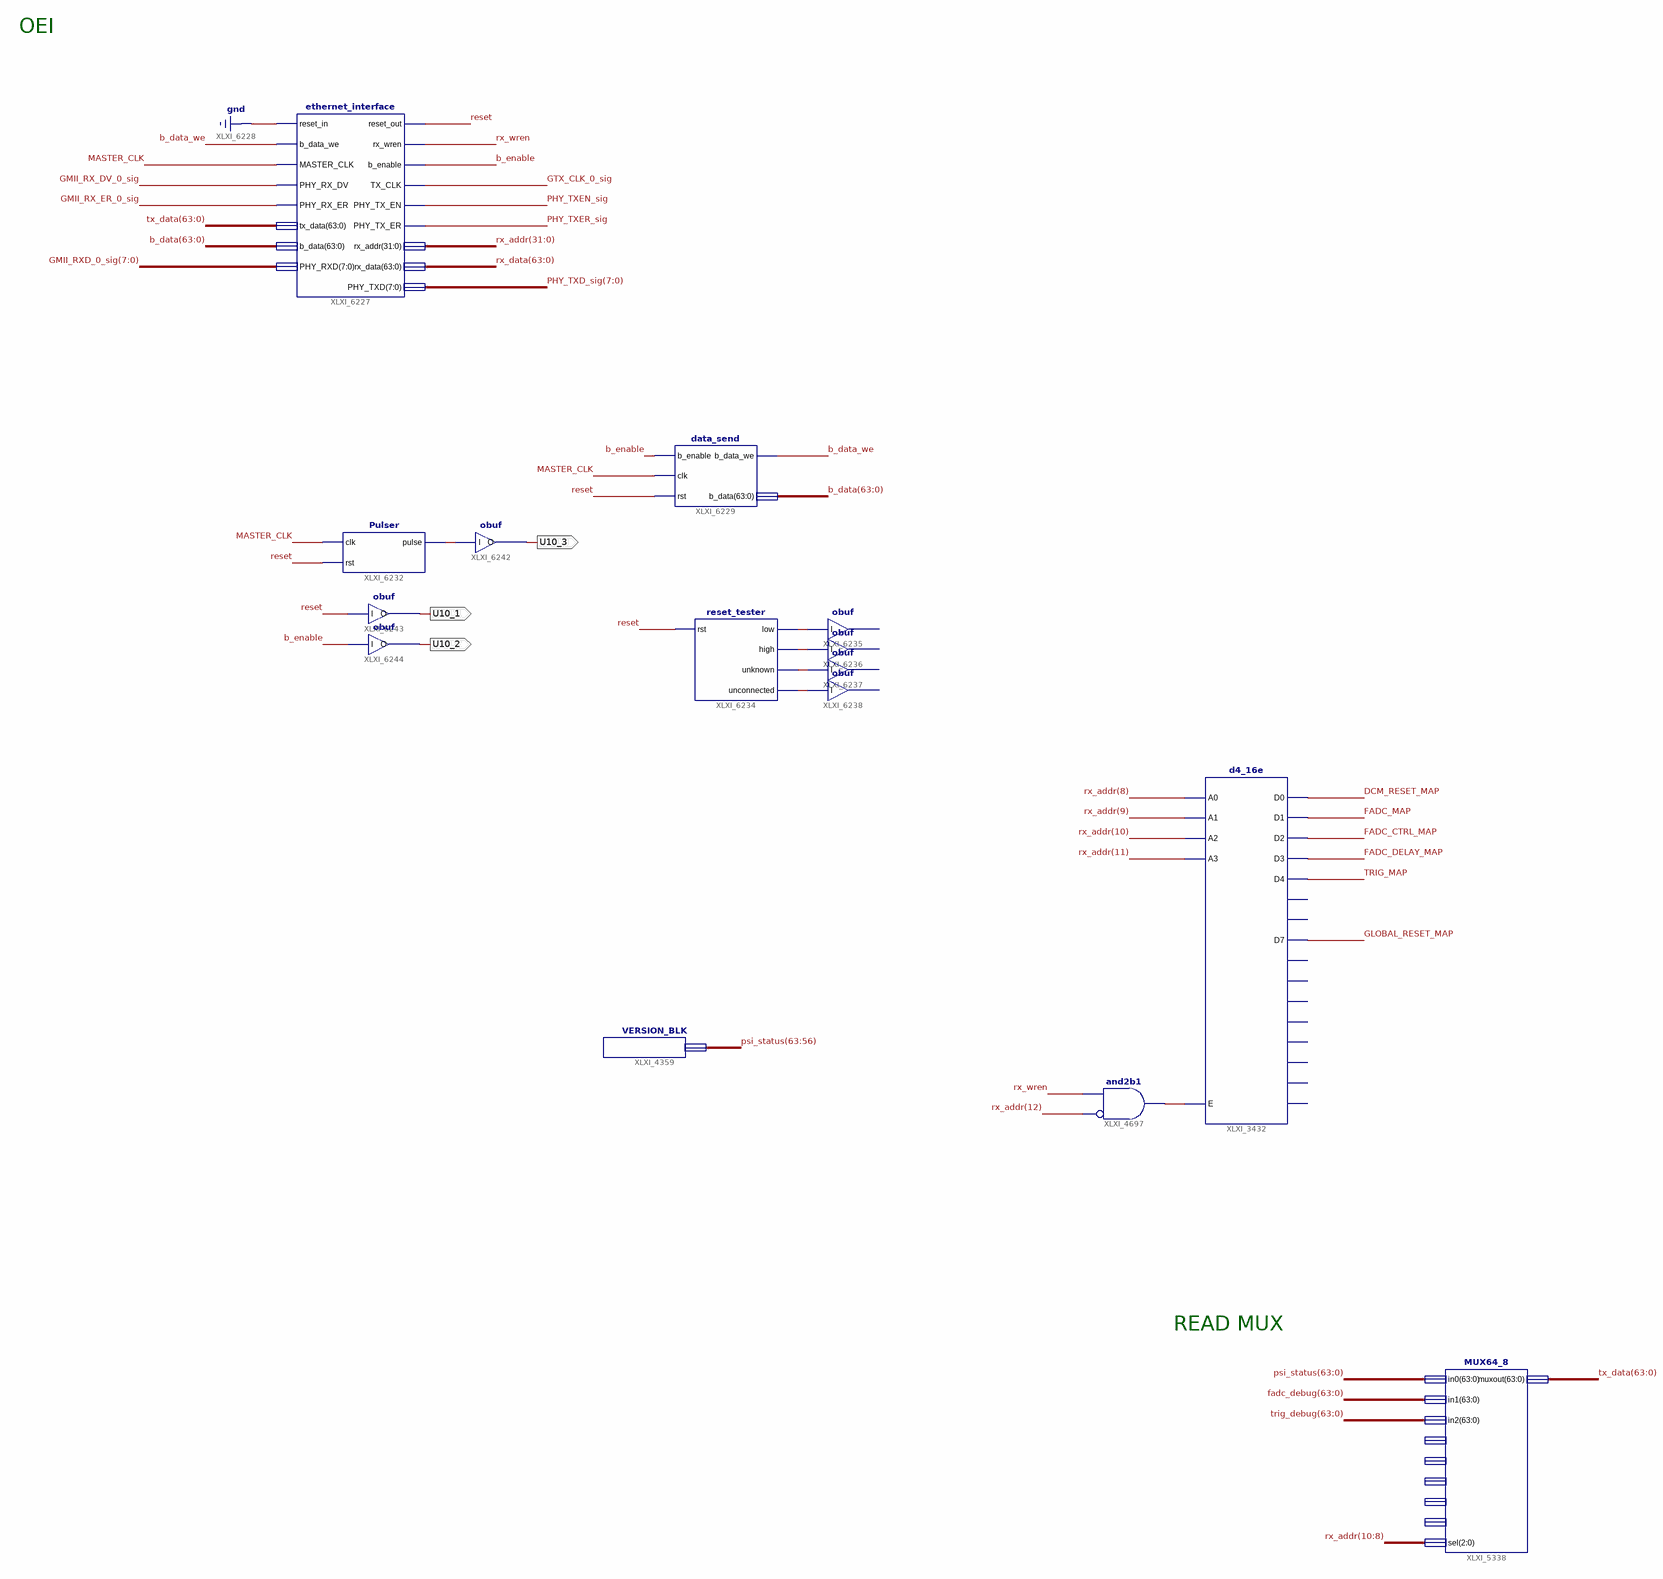
[diagram p0: schematic sheet 1]
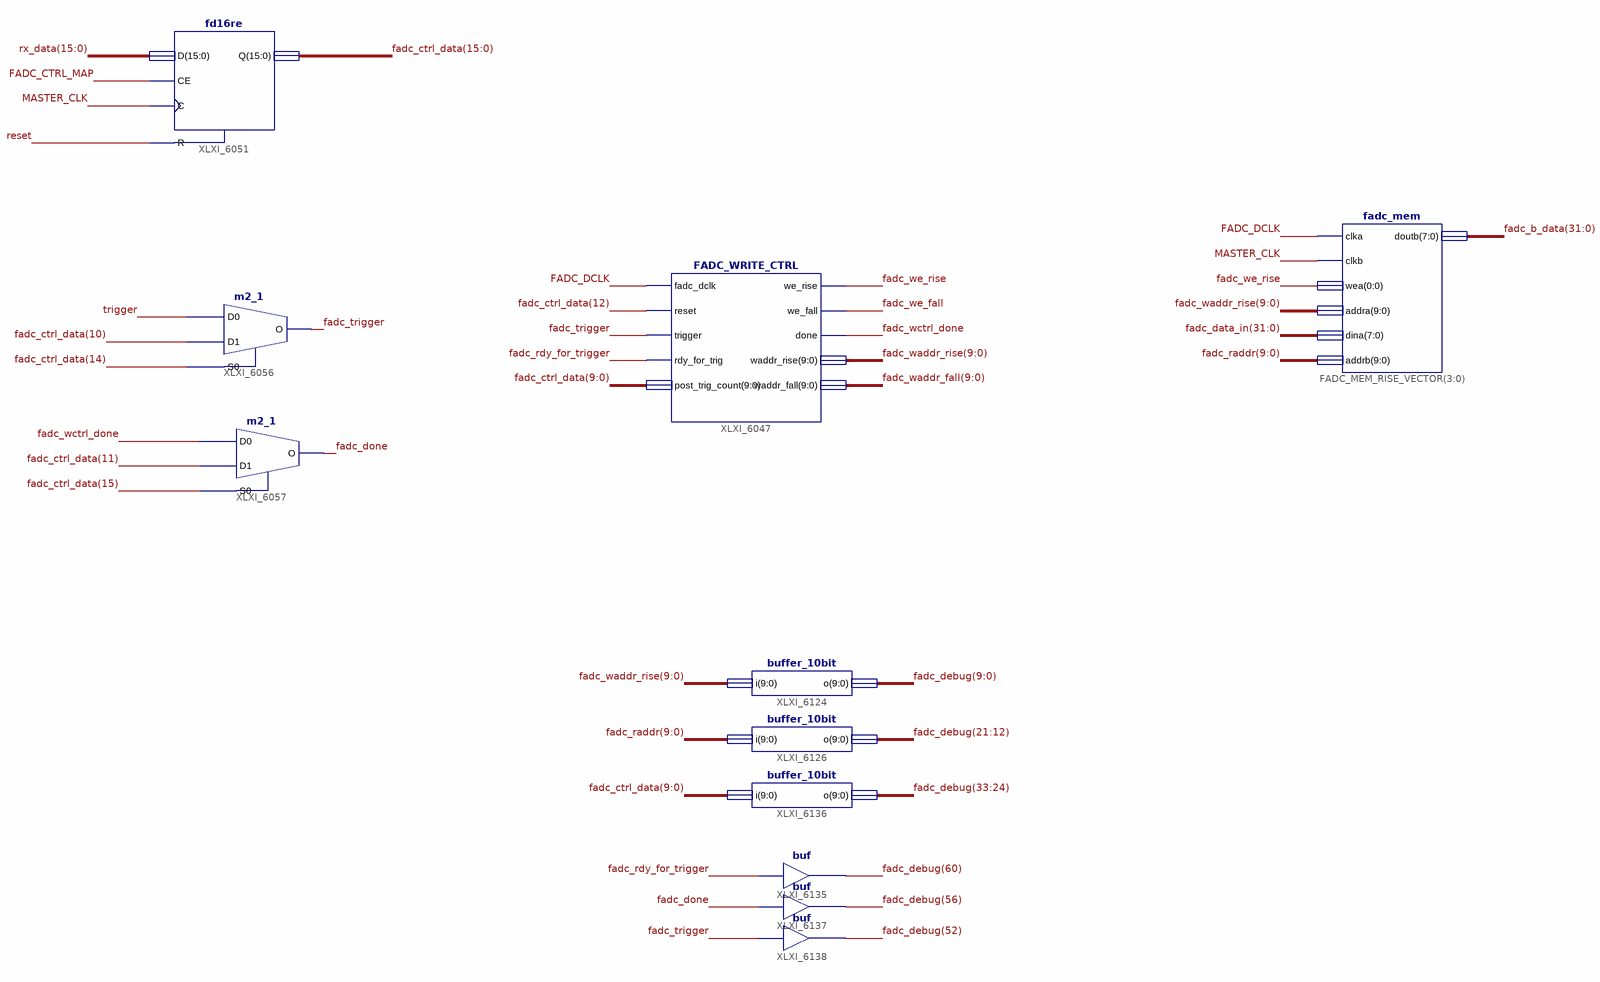
[diagram p1: schematic sheet 2]
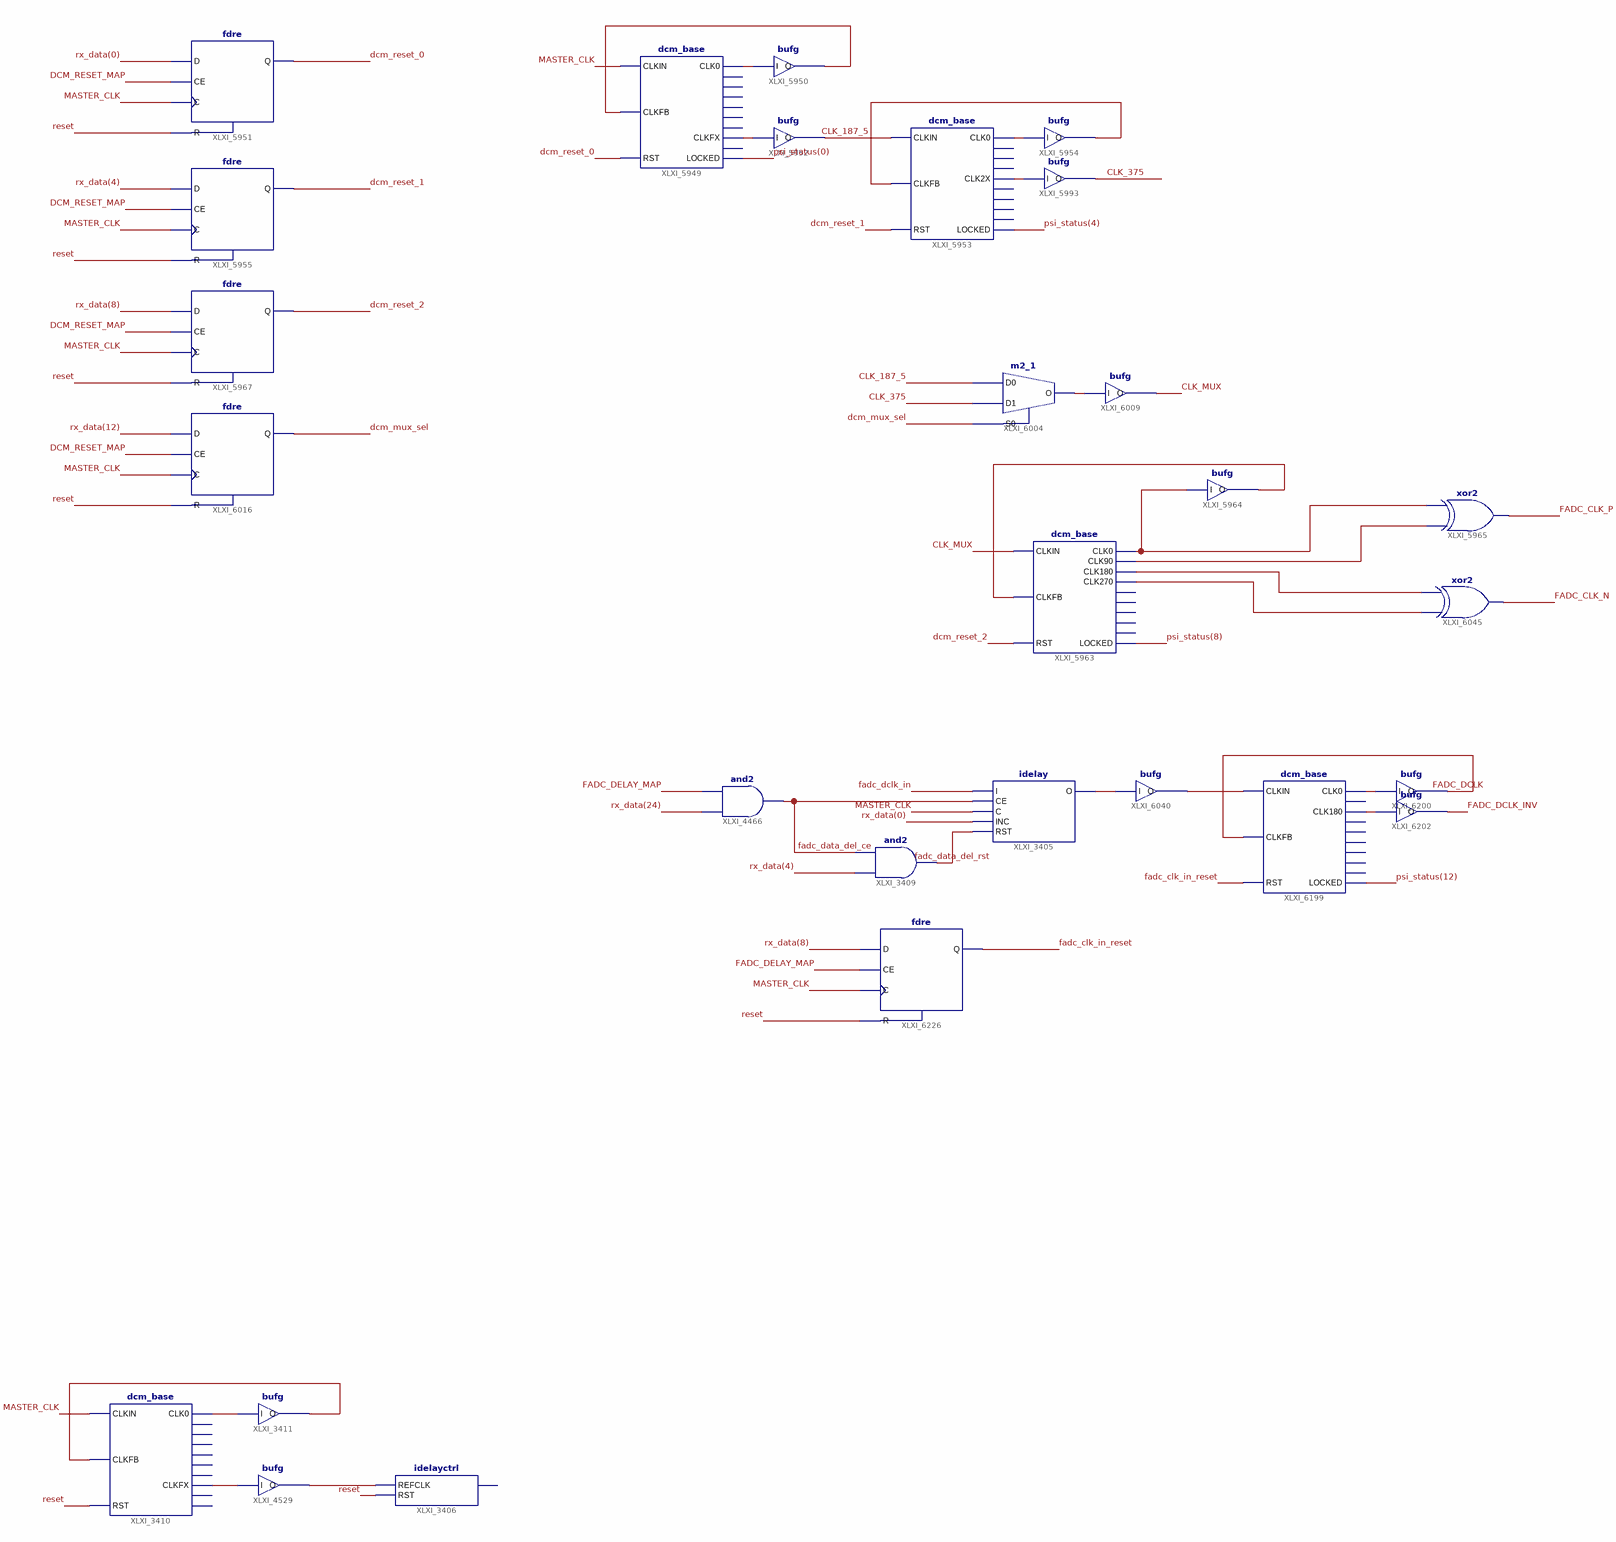
[diagram p2: schematic sheet 4]
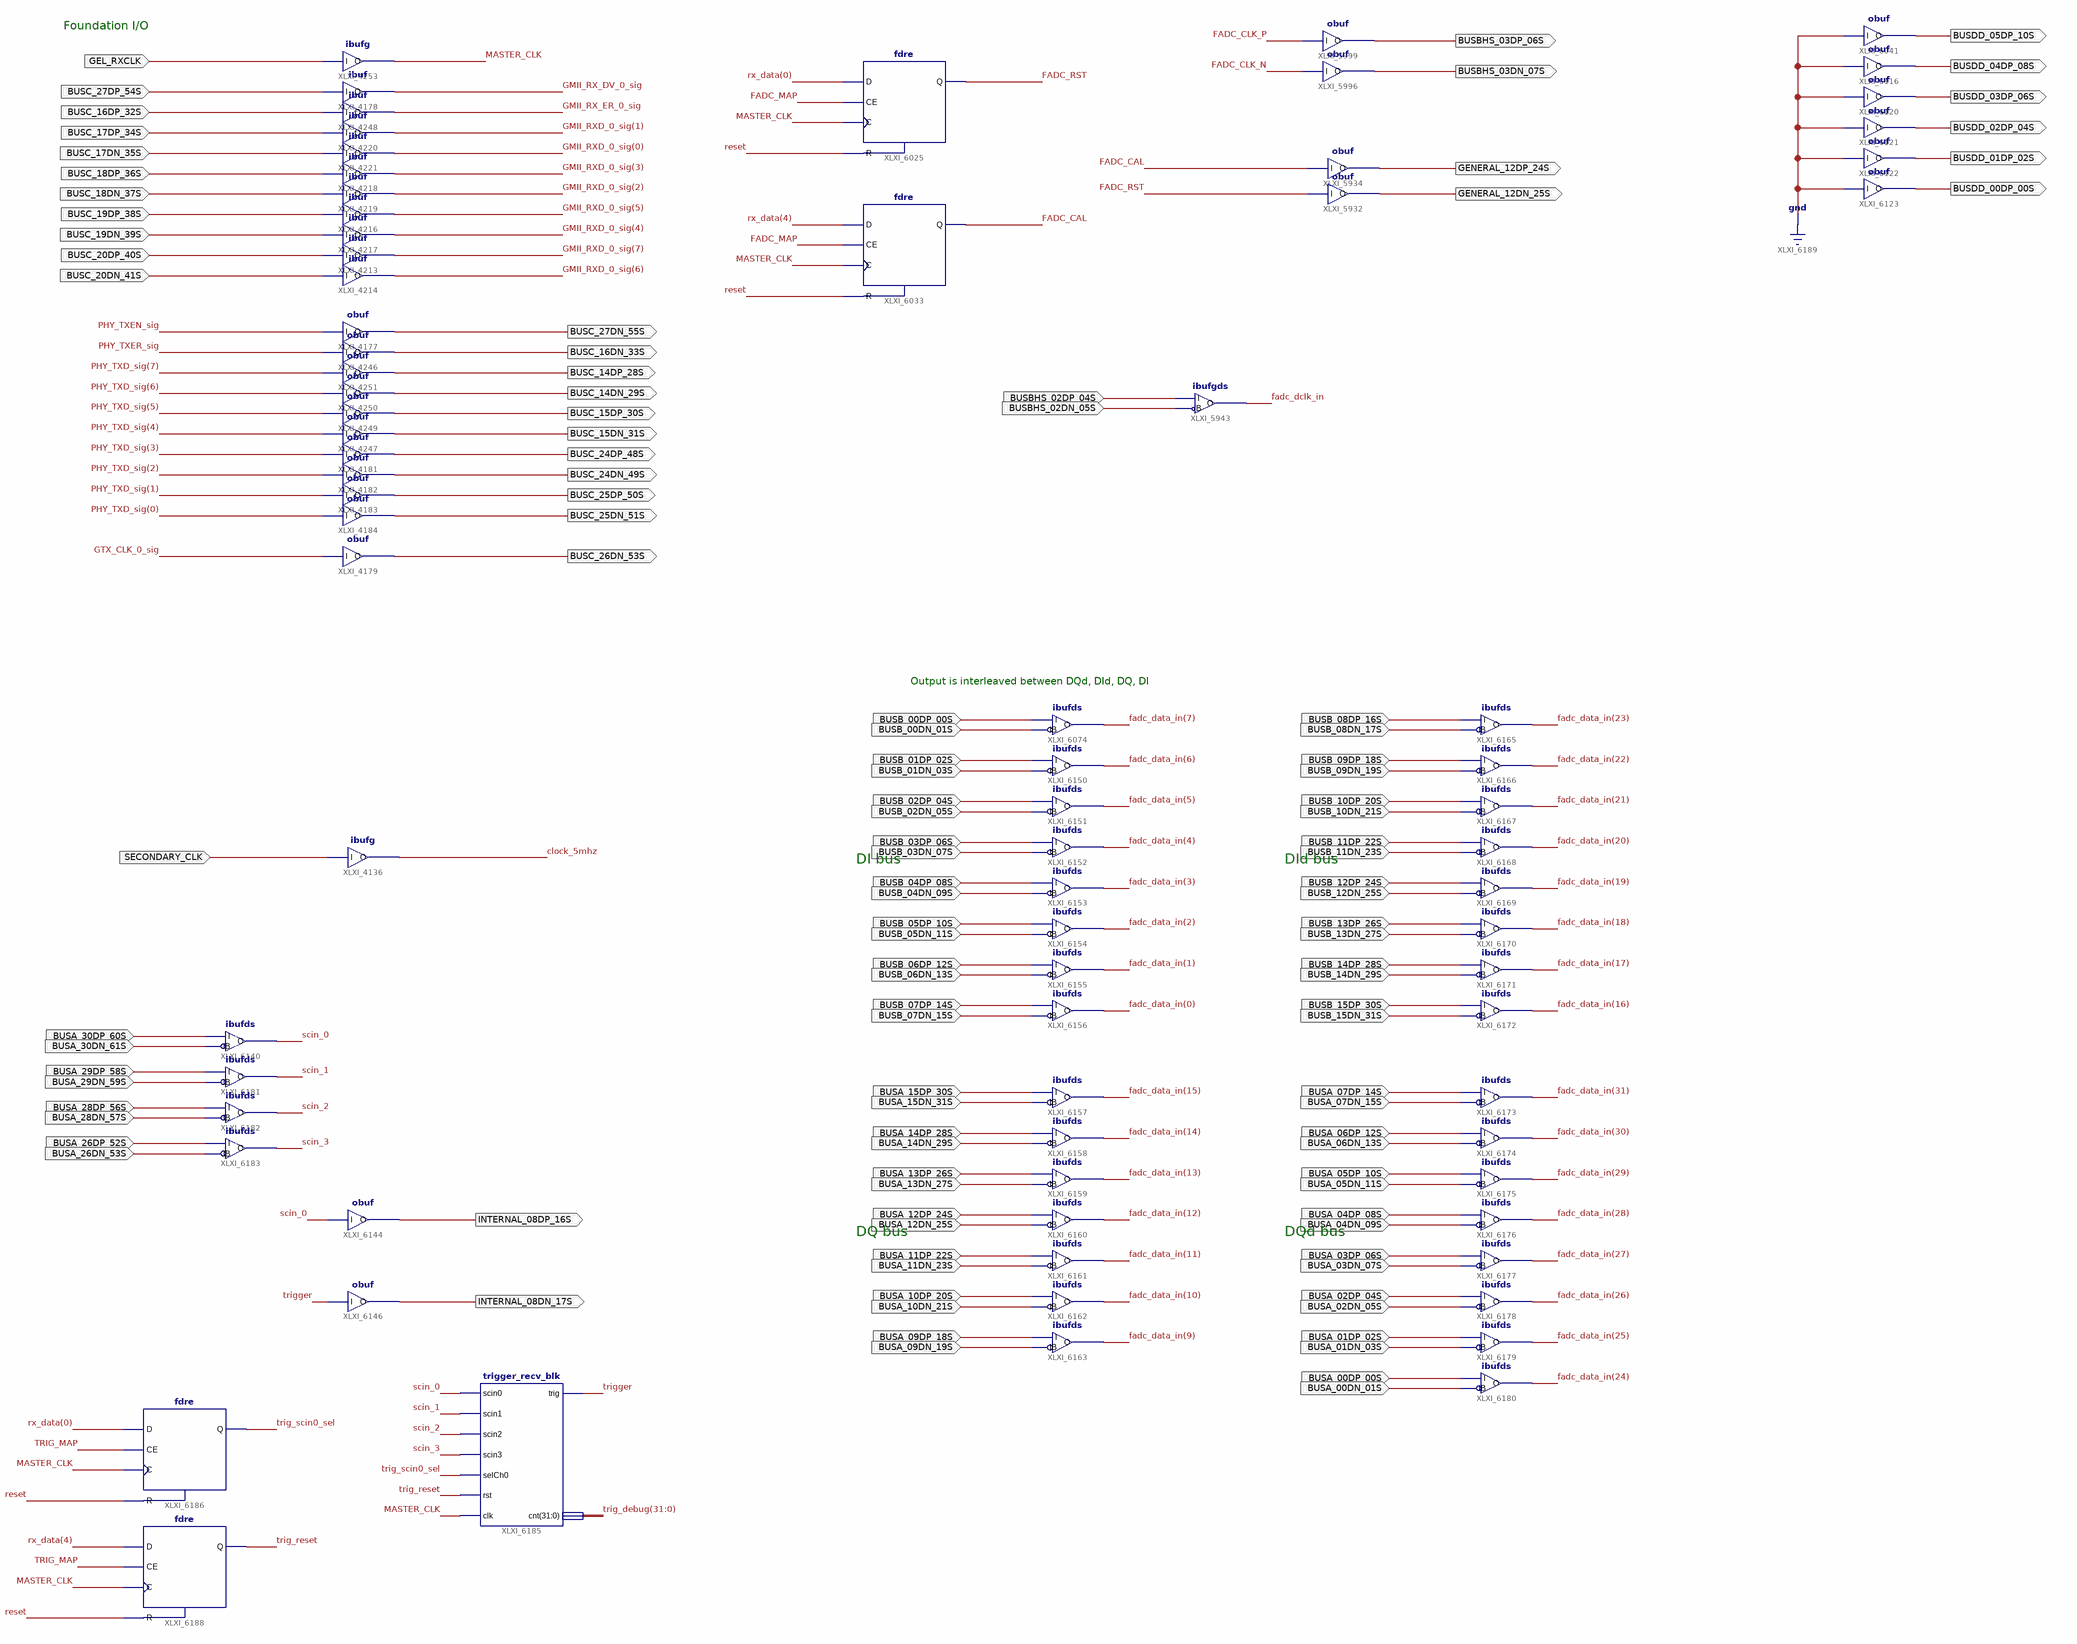
[diagram p3: schematic sheet 5]
// Xilinx ISE schematic TOP_LEVEL.sch (virtex4) as structural Verilog: 130 symbols, 110 ports
module TOP_LEVEL (
  input  BUSC_16DP_32S,
  input  SECONDARY_CLK,
  input  BUSC_20DN_41S,
  input  BUSC_19DN_39S,
  input  BUSC_20DP_40S,
  input  BUSC_19DP_38S,
  input  BUSC_18DP_36S,
  input  BUSC_18DN_37S,
  input  BUSC_17DN_35S,
  input  BUSC_17DP_34S,
  input  BUSC_27DP_54S,
  input  GEL_RXCLK,
  input  BUSBHS_02DP_04S,
  input  BUSBHS_02DN_05S,
  input  BUSB_00DP_00S,
  input  BUSB_00DN_01S,
  input  BUSB_01DP_02S,
  input  BUSB_01DN_03S,
  input  BUSB_02DP_04S,
  input  BUSB_02DN_05S,
  input  BUSB_03DP_06S,
  input  BUSB_03DN_07S,
  input  BUSB_04DP_08S,
  input  BUSB_05DP_10S,
  input  BUSB_05DN_11S,
  input  BUSB_06DP_12S,
  input  BUSB_06DN_13S,
  input  BUSB_07DP_14S,
  input  BUSB_07DN_15S,
  input  BUSB_04DN_09S,
  input  BUSA_15DP_30S,
  input  BUSA_15DN_31S,
  input  BUSA_14DP_28S,
  input  BUSA_14DN_29S,
  input  BUSA_13DP_26S,
  input  BUSA_13DN_27S,
  input  BUSA_11DP_22S,
  input  BUSA_12DN_25S,
  input  BUSA_10DN_21S,
  input  BUSA_10DP_20S,
  input  BUSA_09DP_18S,
  input  BUSA_09DN_19S,
  input  BUSB_08DP_16S,
  input  BUSB_08DN_17S,
  input  BUSB_09DP_18S,
  input  BUSB_09DN_19S,
  input  BUSB_10DP_20S,
  input  BUSB_10DN_21S,
  input  BUSB_11DP_22S,
  input  BUSB_11DN_23S,
  input  BUSB_12DP_24S,
  input  BUSB_12DN_25S,
  input  BUSB_13DP_26S,
  input  BUSB_13DN_27S,
  input  BUSB_14DP_28S,
  input  BUSB_14DN_29S,
  input  BUSB_15DP_30S,
  input  BUSB_15DN_31S,
  input  BUSA_07DP_14S,
  input  BUSA_07DN_15S,
  input  BUSA_06DP_12S,
  input  BUSA_06DN_13S,
  input  BUSA_05DP_10S,
  input  BUSA_05DN_11S,
  input  BUSA_04DP_08S,
  input  BUSA_04DN_09S,
  input  BUSA_03DP_06S,
  input  BUSA_03DN_07S,
  input  BUSA_02DP_04S,
  input  BUSA_02DN_05S,
  input  BUSA_01DP_02S,
  input  BUSA_01DN_03S,
  input  BUSA_00DP_00S,
  input  BUSA_00DN_01S,
  input  BUSA_11DN_23S,
  input  BUSA_12DP_24S,
  input  BUSA_30DP_60S,
  input  BUSA_30DN_61S,
  input  BUSA_29DP_58S,
  input  BUSA_29DN_59S,
  input  BUSA_28DP_56S,
  input  BUSA_28DN_57S,
  input  BUSA_26DP_52S,
  input  BUSA_26DN_53S,
  output BUSC_25DN_51S,
  output BUSC_25DP_50S,
  output BUSC_24DN_49S,
  output BUSC_24DP_48S,
  output BUSC_15DN_31S,
  output BUSC_15DP_30S,
  output BUSC_14DN_29S,
  output BUSC_14DP_28S,
  output BUSC_16DN_33S,
  output BUSC_27DN_55S,
  output BUSC_26DN_53S,
  output GENERAL_12DP_24S,
  output BUSBHS_03DP_06S,
  output BUSBHS_03DN_07S,
  output GENERAL_12DN_25S,
  output INTERNAL_08DP_16S,
  output INTERNAL_08DN_17S,
  output BUSDD_05DP_10S,
  output BUSDD_04DP_08S,
  output BUSDD_03DP_06S,
  output BUSDD_02DP_04S,
  output BUSDD_01DP_02S,
  output BUSDD_00DP_00S,
  output U10_3,
  output U10_1,
  output U10_2
);

  wire b_data_we, b_enable, CLK_187_5, CLK_375, CLK_MUX, clock_5mhz, dcm_mux_sel, dcm_reset_0, dcm_reset_1,
       dcm_reset_2, DCM_RESET_MAP, FADC_CAL, fadc_clk_in_reset, FADC_CLK_N, FADC_CLK_P, FADC_CTRL_MAP,
       fadc_data_del_ce, fadc_data_del_rst, FADC_DCLK, fadc_dclk_in, FADC_DCLK_INV, FADC_DELAY_MAP,
       fadc_done, FADC_MAP, fadc_rdy_for_trigger, FADC_RST, fadc_trigger, fadc_wctrl_done, fadc_we_fall,
       fadc_we_rise, GLOBAL_RESET_MAP, GMII_RX_DV_0_sig, GMII_RX_ER_0_sig, GTX_CLK_0_sig, MASTER_CLK,
       PHY_TXEN_sig, PHY_TXER_sig, reset, rx_wren, scin_0, scin_1, scin_2, scin_3, TRIG_MAP, trig_reset,
       trig_scin0_sel, trigger, XLXN_12220, XLXN_12229, XLXN_12257, XLXN_12617, XLXN_12660, XLXN_12661,
       XLXN_12669, XLXN_12671, XLXN_12672, XLXN_12697, XLXN_12781, XLXN_12783, XLXN_12809, XLXN_12923,
       XLXN_12930, XLXN_12931, XLXN_15064, XLXN_15075, XLXN_15087, XLXN_15092, XLXN_15130, XLXN_15151,
       XLXN_15152, XLXN_15153, XLXN_15154, XLXN_15166;
  wire [7:0] GMII_RXD_0_sig, PHY_TXD_sig;
  wire [9:0] fadc_raddr, fadc_waddr_fall, fadc_waddr_rise;
  wire [15:0] fadc_ctrl_data;
  wire [31:0] fadc_b_data, fadc_data_in, rx_addr;
  wire [63:0] b_data, fadc_debug, psi_status, rx_data, trig_debug, tx_data;

  ibuf XLXI_4248 (.I(BUSC_16DP_32S), .O(GMII_RX_ER_0_sig));
  ibufg XLXI_4136 (.I(SECONDARY_CLK), .O(clock_5mhz));
  obuf XLXI_4181 (.I(PHY_TXD_sig[3]), .O(BUSC_24DP_48S));
  obuf XLXI_4182 (.I(PHY_TXD_sig[2]), .O(BUSC_24DN_49S));
  obuf XLXI_4183 (.I(PHY_TXD_sig[1]), .O(BUSC_25DP_50S));
  obuf XLXI_4184 (.I(PHY_TXD_sig[0]), .O(BUSC_25DN_51S));
  obuf XLXI_4247 (.I(PHY_TXD_sig[4]), .O(BUSC_15DN_31S));
  obuf XLXI_4249 (.I(PHY_TXD_sig[5]), .O(BUSC_15DP_30S));
  obuf XLXI_4250 (.I(PHY_TXD_sig[6]), .O(BUSC_14DN_29S));
  obuf XLXI_4251 (.I(PHY_TXD_sig[7]), .O(BUSC_14DP_28S));
  obuf XLXI_4246 (.I(PHY_TXER_sig), .O(BUSC_16DN_33S));
  ibuf XLXI_4213 (.I(BUSC_20DP_40S), .O(GMII_RXD_0_sig[7]));
  ibuf XLXI_4214 (.I(BUSC_20DN_41S), .O(GMII_RXD_0_sig[6]));
  ibuf XLXI_4216 (.I(BUSC_19DP_38S), .O(GMII_RXD_0_sig[5]));
  ibuf XLXI_4217 (.I(BUSC_19DN_39S), .O(GMII_RXD_0_sig[4]));
  ibuf XLXI_4218 (.I(BUSC_18DP_36S), .O(GMII_RXD_0_sig[3]));
  ibuf XLXI_4219 (.I(BUSC_18DN_37S), .O(GMII_RXD_0_sig[2]));
  ibuf XLXI_4220 (.I(BUSC_17DP_34S), .O(GMII_RXD_0_sig[1]));
  ibuf XLXI_4221 (.I(BUSC_17DN_35S), .O(GMII_RXD_0_sig[0]));
  obuf XLXI_4177 (.I(PHY_TXEN_sig), .O(BUSC_27DN_55S));
  ibuf XLXI_4178 (.I(BUSC_27DP_54S), .O(GMII_RX_DV_0_sig));
  ibufg XLXI_4253 (.I(GEL_RXCLK), .O(MASTER_CLK));
  obuf XLXI_4179 (.I(GTX_CLK_0_sig), .O(BUSC_26DN_53S));
  VERSION_BLK XLXI_4359 (.version(psi_status[63:56]));
  d4_16e XLXI_3432 (
    .A0(rx_addr[8]), .A1(rx_addr[9]), .A2(rx_addr[10]), .A3(rx_addr[11]), .E(XLXN_12617), .D0(DCM_RESET_MAP),
    .D1(FADC_MAP), .D2(FADC_CTRL_MAP), .D3(FADC_DELAY_MAP), .D4(TRIG_MAP), .D7(GLOBAL_RESET_MAP));  // open: D10, D11, D12, D13, D14, D15, D5, D6, D8, D9
  and XLXI_4697 (XLXN_12617, ~rx_addr[12], rx_wren);  // and2b1
  MUX64_8 XLXI_5338 (
    .in0(psi_status), .in1(fadc_debug), .in2(trig_debug), .sel(rx_addr[10:8]), .muxout(tx_data));  // open: in3, in4, in5, in6, in7
  fdre XLXI_5951 (.C(MASTER_CLK), .CE(DCM_RESET_MAP), .D(rx_data[0]), .R(reset), .Q(dcm_reset_0));
  dcm_base #(.CLKIN_PERIOD(8), .CLKFX_MULTIPLY(3), .CLKFX_DIVIDE(2)) XLXI_5949 (
    .CLKIN(MASTER_CLK), .CLKFB(XLXN_12661), .RST(dcm_reset_0), .CLK0(XLXN_12660), .CLKFX(XLXN_12669),
    .LOCKED(psi_status[0]));  // open: CLK90, CLK180, CLK270, CLK2X, CLK2X180, CLKDV, CLKFX180
  bufg XLXI_5950 (.I(XLXN_12660), .O(XLXN_12661));
  bufg XLXI_5952 (.I(XLXN_12669), .O(CLK_187_5));
  dcm_base #(.DLL_FREQUENCY_MODE("HIGH"), .DFS_FREQUENCY_MODE("HIGH"), .CLKIN_PERIOD(5.33333333)) XLXI_5953 (
    .CLKIN(CLK_187_5), .CLKFB(XLXN_12672), .RST(dcm_reset_1), .CLK0(XLXN_12671), .CLK2X(XLXN_12781),
    .LOCKED(psi_status[4]));  // open: CLK90, CLK180, CLK270, CLK2X180, CLKDV, CLKFX, CLKFX180
  bufg XLXI_5954 (.I(XLXN_12671), .O(XLXN_12672));
  fdre XLXI_5955 (.C(MASTER_CLK), .CE(DCM_RESET_MAP), .D(rx_data[4]), .R(reset), .Q(dcm_reset_1));
  fdre XLXI_5967 (.C(MASTER_CLK), .CE(DCM_RESET_MAP), .D(rx_data[8]), .R(reset), .Q(dcm_reset_2));
  bufg XLXI_5993 (.I(XLXN_12781), .O(CLK_375));
  obuf #(.SLEW("FAST"), .CAPACITANCE("DONT_CARE")) XLXI_5996 (.I(FADC_CLK_N), .O(BUSBHS_03DN_07S));
  obuf #(.SLEW("FAST"), .CAPACITANCE("DONT_CARE")) XLXI_5999 (.I(FADC_CLK_P), .O(BUSBHS_03DP_06S));
  m2_1 XLXI_6004 (.D0(CLK_187_5), .D1(CLK_375), .S0(dcm_mux_sel), .O(XLXN_12809));
  dcm_base #(.DLL_FREQUENCY_MODE("HIGH"), .DFS_FREQUENCY_MODE("HIGH"), .CLKIN_PERIOD(2.66666667)) XLXI_5963 (
    .CLKIN(CLK_MUX), .CLKFB(XLXN_12923), .RST(dcm_reset_2), .CLK0(XLXN_12697), .CLK90(XLXN_12783),
    .CLK180(XLXN_12930), .CLK270(XLXN_12931), .LOCKED(psi_status[8]));  // open: CLK2X, CLK2X180, CLKDV, CLKFX, CLKFX180
  bufg XLXI_5964 (.I(XLXN_12697), .O(XLXN_12923));
  bufg XLXI_6009 (.I(XLXN_12809), .O(CLK_MUX));
  xor XLXI_5965 (FADC_CLK_P, XLXN_12783, XLXN_12697);
  fdre XLXI_6016 (.C(MASTER_CLK), .CE(DCM_RESET_MAP), .D(rx_data[12]), .R(reset), .Q(dcm_mux_sel));
  fdre XLXI_6025 (.C(MASTER_CLK), .CE(FADC_MAP), .D(rx_data[0]), .R(reset), .Q(FADC_RST));
  fdre XLXI_6033 (.C(MASTER_CLK), .CE(FADC_MAP), .D(rx_data[4]), .R(reset), .Q(FADC_CAL));
  ibufgds #(.DIFF_TERM("TRUE"), .CAPACITANCE("LOW")) XLXI_5943 (
    .I(BUSBHS_02DP_04S), .IB(BUSBHS_02DN_05S), .O(fadc_dclk_in));
  obuf XLXI_5934 (.I(FADC_CAL), .O(GENERAL_12DP_24S));
  obuf XLXI_5932 (.I(FADC_RST), .O(GENERAL_12DN_25S));
  xor XLXI_6045 (FADC_CLK_N, XLXN_12931, XLXN_12930);
  fd16re XLXI_6051 (.C(MASTER_CLK), .CE(FADC_CTRL_MAP), .D(rx_data[15:0]), .R(reset), .Q(fadc_ctrl_data));
  m2_1 XLXI_6056 (.D0(trigger), .D1(fadc_ctrl_data[10]), .S0(fadc_ctrl_data[14]), .O(fadc_trigger));
  m2_1 XLXI_6057 (.D0(fadc_wctrl_done), .D1(fadc_ctrl_data[11]), .S0(fadc_ctrl_data[15]), .O(fadc_done));
  FADC_WRITE_CTRL XLXI_6047 (
    .fadc_dclk(FADC_DCLK), .reset(fadc_ctrl_data[12]), .trigger(fadc_trigger),
    .rdy_for_trig(fadc_rdy_for_trigger), .post_trig_count(fadc_ctrl_data[9:0]), .we_rise(fadc_we_rise),
    .we_fall(fadc_we_fall), .done(fadc_wctrl_done), .waddr_rise(fadc_waddr_rise), .waddr_fall(fadc_waddr_fall));
  fadc_mem FADC_MEM_RISE_VECTOR[3:0] (
    .clka(FADC_DCLK), .clkb(MASTER_CLK), .wea(fadc_we_rise), .addra(fadc_waddr_rise), .dina(fadc_data_in),
    .addrb(fadc_raddr), .doutb(fadc_b_data));
  ibufds #(.DIFF_TERM("TRUE"), .CAPACITANCE("DONT_CARE")) XLXI_6074 (
    .I(BUSB_00DP_00S), .IB(BUSB_00DN_01S), .O(fadc_data_in[7]));
  dcm_base #(.CLKIN_PERIOD(8), .CLKFX_MULTIPLY(8), .CLKFX_DIVIDE(5)) XLXI_3410 (
    .CLKIN(MASTER_CLK), .CLKFB(XLXN_12229), .RST(reset), .CLK0(XLXN_12220), .CLKFX(XLXN_12257));  // open: CLK90, CLK180, CLK270, CLK2X, CLK2X180, CLKDV, CLKFX180, LOCKED
  bufg XLXI_3411 (.I(XLXN_12220), .O(XLXN_12229));
  idelayctrl XLXI_3406 (.REFCLK(XLXN_15064), .RST(reset));  // open: RDY
  bufg XLXI_4529 (.I(XLXN_12257), .O(XLXN_15064));
  ibufds #(.DIFF_TERM("TRUE"), .CAPACITANCE("DONT_CARE")) XLXI_6140 (.I(BUSA_30DP_60S), .IB(BUSA_30DN_61S), .O(scin_0));
  obuf XLXI_6144 (.I(scin_0), .O(INTERNAL_08DP_16S));
  obuf XLXI_6146 (.I(trigger), .O(INTERNAL_08DN_17S));
  ibufds #(.DIFF_TERM("TRUE"), .CAPACITANCE("DONT_CARE")) XLXI_6150 (
    .I(BUSB_01DP_02S), .IB(BUSB_01DN_03S), .O(fadc_data_in[6]));
  ibufds #(.DIFF_TERM("TRUE"), .CAPACITANCE("DONT_CARE")) XLXI_6151 (
    .I(BUSB_02DP_04S), .IB(BUSB_02DN_05S), .O(fadc_data_in[5]));
  ibufds #(.DIFF_TERM("TRUE"), .CAPACITANCE("DONT_CARE")) XLXI_6152 (
    .I(BUSB_03DP_06S), .IB(BUSB_03DN_07S), .O(fadc_data_in[4]));
  ibufds #(.DIFF_TERM("TRUE"), .CAPACITANCE("DONT_CARE")) XLXI_6153 (
    .I(BUSB_04DP_08S), .IB(BUSB_04DN_09S), .O(fadc_data_in[3]));
  ibufds #(.DIFF_TERM("TRUE"), .CAPACITANCE("DONT_CARE")) XLXI_6154 (
    .I(BUSB_05DP_10S), .IB(BUSB_05DN_11S), .O(fadc_data_in[2]));
  ibufds #(.DIFF_TERM("TRUE"), .CAPACITANCE("DONT_CARE")) XLXI_6155 (
    .I(BUSB_06DP_12S), .IB(BUSB_06DN_13S), .O(fadc_data_in[1]));
  ibufds #(.DIFF_TERM("TRUE"), .CAPACITANCE("DONT_CARE")) XLXI_6156 (
    .I(BUSB_07DP_14S), .IB(BUSB_07DN_15S), .O(fadc_data_in[0]));
  ibufds #(.DIFF_TERM("TRUE"), .CAPACITANCE("DONT_CARE")) XLXI_6157 (
    .I(BUSA_15DP_30S), .IB(BUSA_15DN_31S), .O(fadc_data_in[15]));
  ibufds #(.DIFF_TERM("TRUE"), .CAPACITANCE("DONT_CARE")) XLXI_6158 (
    .I(BUSA_14DP_28S), .IB(BUSA_14DN_29S), .O(fadc_data_in[14]));
  ibufds #(.DIFF_TERM("TRUE"), .CAPACITANCE("DONT_CARE")) XLXI_6159 (
    .I(BUSA_13DP_26S), .IB(BUSA_13DN_27S), .O(fadc_data_in[13]));
  ibufds #(.DIFF_TERM("TRUE"), .CAPACITANCE("DONT_CARE")) XLXI_6160 (
    .I(BUSA_12DP_24S), .IB(BUSA_12DN_25S), .O(fadc_data_in[12]));
  ibufds #(.DIFF_TERM("TRUE"), .CAPACITANCE("DONT_CARE")) XLXI_6161 (
    .I(BUSA_11DP_22S), .IB(BUSA_11DN_23S), .O(fadc_data_in[11]));
  ibufds #(.DIFF_TERM("TRUE"), .CAPACITANCE("DONT_CARE")) XLXI_6162 (
    .I(BUSA_10DP_20S), .IB(BUSA_10DN_21S), .O(fadc_data_in[10]));
  ibufds #(.DIFF_TERM("TRUE"), .CAPACITANCE("DONT_CARE")) XLXI_6163 (
    .I(BUSA_09DP_18S), .IB(BUSA_09DN_19S), .O(fadc_data_in[9]));
  ibufds #(.DIFF_TERM("TRUE"), .CAPACITANCE("DONT_CARE")) XLXI_6165 (
    .I(BUSB_08DP_16S), .IB(BUSB_08DN_17S), .O(fadc_data_in[23]));
  ibufds #(.DIFF_TERM("TRUE"), .CAPACITANCE("DONT_CARE")) XLXI_6166 (
    .I(BUSB_09DP_18S), .IB(BUSB_09DN_19S), .O(fadc_data_in[22]));
  ibufds #(.DIFF_TERM("TRUE"), .CAPACITANCE("DONT_CARE")) XLXI_6167 (
    .I(BUSB_10DP_20S), .IB(BUSB_10DN_21S), .O(fadc_data_in[21]));
  ibufds #(.DIFF_TERM("TRUE"), .CAPACITANCE("DONT_CARE")) XLXI_6168 (
    .I(BUSB_11DP_22S), .IB(BUSB_11DN_23S), .O(fadc_data_in[20]));
  ibufds #(.DIFF_TERM("TRUE"), .CAPACITANCE("DONT_CARE")) XLXI_6169 (
    .I(BUSB_12DP_24S), .IB(BUSB_12DN_25S), .O(fadc_data_in[19]));
  ibufds #(.DIFF_TERM("TRUE"), .CAPACITANCE("DONT_CARE")) XLXI_6170 (
    .I(BUSB_13DP_26S), .IB(BUSB_13DN_27S), .O(fadc_data_in[18]));
  ibufds #(.DIFF_TERM("TRUE"), .CAPACITANCE("DONT_CARE")) XLXI_6171 (
    .I(BUSB_14DP_28S), .IB(BUSB_14DN_29S), .O(fadc_data_in[17]));
  ibufds #(.DIFF_TERM("TRUE"), .CAPACITANCE("DONT_CARE")) XLXI_6172 (
    .I(BUSB_15DP_30S), .IB(BUSB_15DN_31S), .O(fadc_data_in[16]));
  ibufds #(.DIFF_TERM("TRUE"), .CAPACITANCE("DONT_CARE")) XLXI_6173 (
    .I(BUSA_07DP_14S), .IB(BUSA_07DN_15S), .O(fadc_data_in[31]));
  ibufds #(.DIFF_TERM("TRUE"), .CAPACITANCE("DONT_CARE")) XLXI_6174 (
    .I(BUSA_06DP_12S), .IB(BUSA_06DN_13S), .O(fadc_data_in[30]));
  ibufds #(.DIFF_TERM("TRUE"), .CAPACITANCE("DONT_CARE")) XLXI_6175 (
    .I(BUSA_05DP_10S), .IB(BUSA_05DN_11S), .O(fadc_data_in[29]));
  ibufds #(.DIFF_TERM("TRUE"), .CAPACITANCE("DONT_CARE")) XLXI_6176 (
    .I(BUSA_04DP_08S), .IB(BUSA_04DN_09S), .O(fadc_data_in[28]));
  ibufds #(.DIFF_TERM("TRUE"), .CAPACITANCE("DONT_CARE")) XLXI_6177 (
    .I(BUSA_03DP_06S), .IB(BUSA_03DN_07S), .O(fadc_data_in[27]));
  ibufds #(.DIFF_TERM("TRUE"), .CAPACITANCE("DONT_CARE")) XLXI_6178 (
    .I(BUSA_02DP_04S), .IB(BUSA_02DN_05S), .O(fadc_data_in[26]));
  ibufds #(.DIFF_TERM("TRUE"), .CAPACITANCE("DONT_CARE")) XLXI_6179 (
    .I(BUSA_01DP_02S), .IB(BUSA_01DN_03S), .O(fadc_data_in[25]));
  ibufds #(.DIFF_TERM("TRUE"), .CAPACITANCE("DONT_CARE")) XLXI_6180 (
    .I(BUSA_00DP_00S), .IB(BUSA_00DN_01S), .O(fadc_data_in[24]));
  ibufds #(.DIFF_TERM("TRUE"), .CAPACITANCE("DONT_CARE")) XLXI_6181 (.I(BUSA_29DP_58S), .IB(BUSA_29DN_59S), .O(scin_1));
  ibufds #(.DIFF_TERM("TRUE"), .CAPACITANCE("DONT_CARE")) XLXI_6182 (.I(BUSA_28DP_56S), .IB(BUSA_28DN_57S), .O(scin_2));
  ibufds #(.DIFF_TERM("TRUE"), .CAPACITANCE("DONT_CARE")) XLXI_6183 (.I(BUSA_26DP_52S), .IB(BUSA_26DN_53S), .O(scin_3));
  trigger_recv_blk XLXI_6185 (
    .scin0(scin_0), .scin1(scin_1), .scin2(scin_2), .scin3(scin_3), .selCh0(trig_scin0_sel),
    .rst(trig_reset), .clk(MASTER_CLK), .trig(trigger), .cnt(trig_debug[31:0]));
  fdre XLXI_6186 (.C(MASTER_CLK), .CE(TRIG_MAP), .D(rx_data[0]), .R(reset), .Q(trig_scin0_sel));
  fdre XLXI_6188 (.C(MASTER_CLK), .CE(TRIG_MAP), .D(rx_data[4]), .R(reset), .Q(trig_reset));
  buffer_10bit XLXI_6126 (.i(fadc_raddr), .o(fadc_debug[21:12]));
  buffer_10bit XLXI_6136 (.i(fadc_ctrl_data[9:0]), .o(fadc_debug[33:24]));
  buf XLXI_6137 (fadc_debug[56], fadc_done);
  buf XLXI_6138 (fadc_debug[52], fadc_trigger);
  buf XLXI_6135 (fadc_debug[60], fadc_rdy_for_trigger);
  buffer_10bit XLXI_6124 (.i(fadc_waddr_rise), .o(fadc_debug[9:0]));
  obuf #(.SLEW("FAST")) XLXI_6041 (.I(1'b0), .O(BUSDD_05DP_10S));
  obuf #(.SLEW("FAST")) XLXI_6116 (.I(1'b0), .O(BUSDD_04DP_08S));
  obuf #(.SLEW("FAST")) XLXI_6120 (.I(1'b0), .O(BUSDD_03DP_06S));
  obuf #(.SLEW("FAST")) XLXI_6121 (.I(1'b0), .O(BUSDD_02DP_04S));
  obuf #(.SLEW("FAST")) XLXI_6122 (.I(1'b0), .O(BUSDD_01DP_02S));
  obuf #(.SLEW("FAST")) XLXI_6123 (.I(1'b0), .O(BUSDD_00DP_00S));
  dcm_base #(.DLL_FREQUENCY_MODE("HIGH"), .DFS_FREQUENCY_MODE("HIGH"), .CLKIN_PERIOD(5.33333333)) XLXI_6199 (
    .CLKIN(XLXN_15130), .CLKFB(FADC_DCLK), .RST(fadc_clk_in_reset), .CLK0(XLXN_15087), .CLK180(XLXN_15092),
    .LOCKED(psi_status[12]));  // open: CLK90, CLK270, CLK2X, CLK2X180, CLKDV, CLKFX, CLKFX180
  bufg XLXI_6200 (.I(XLXN_15087), .O(FADC_DCLK));
  bufg XLXI_6202 (.I(XLXN_15092), .O(FADC_DCLK_INV));
  idelay #(.IOBDELAY_TYPE("VARIABLE")) XLXI_3405 (
    .I(fadc_dclk_in), .CE(fadc_data_del_ce), .C(MASTER_CLK), .INC(rx_data[0]), .RST(fadc_data_del_rst),
    .O(XLXN_15075));
  and XLXI_4466 (fadc_data_del_ce, rx_data[24], FADC_DELAY_MAP);
  and XLXI_3409 (fadc_data_del_rst, rx_data[4], fadc_data_del_ce);
  bufg XLXI_6040 (.I(XLXN_15075), .O(XLXN_15130));
  fdre XLXI_6226 (.C(MASTER_CLK), .CE(FADC_DELAY_MAP), .D(rx_data[8]), .R(reset), .Q(fadc_clk_in_reset));
  ethernet_interface XLXI_6227 (
    .reset_in(1'b0), .b_data_we(b_data_we), .MASTER_CLK(MASTER_CLK), .PHY_RX_DV(GMII_RX_DV_0_sig),
    .PHY_RX_ER(GMII_RX_ER_0_sig), .tx_data(tx_data), .b_data(b_data), .PHY_RXD(GMII_RXD_0_sig),
    .reset_out(reset), .rx_wren(rx_wren), .b_enable(b_enable), .TX_CLK(GTX_CLK_0_sig),
    .PHY_TX_EN(PHY_TXEN_sig), .PHY_TX_ER(PHY_TXER_sig), .rx_addr(rx_addr), .rx_data(rx_data),
    .PHY_TXD(PHY_TXD_sig));
  data_send XLXI_6229 (.b_enable(b_enable), .clk(MASTER_CLK), .rst(reset), .b_data_we(b_data_we), .b_data(b_data));
  Pulser XLXI_6232 (.clk(MASTER_CLK), .rst(reset), .pulse(XLXN_15166));
  reset_tester XLXI_6234 (
    .rst(reset), .low(XLXN_15151), .high(XLXN_15152), .unknown(XLXN_15153), .unconnected(XLXN_15154));
  obuf XLXI_6235 (.I(XLXN_15151));  // open: O
  obuf XLXI_6236 (.I(XLXN_15152));  // open: O
  obuf XLXI_6237 (.I(XLXN_15153));  // open: O
  obuf XLXI_6238 (.I(XLXN_15154));  // open: O
  obuf XLXI_6242 (.I(XLXN_15166), .O(U10_3));
  obuf XLXI_6243 (.I(reset), .O(U10_1));
  obuf XLXI_6244 (.I(b_enable), .O(U10_2));

  // Notes on the sheet:
  //   OEI
  //   READ MUX
  //   Foundation I/O
  //   Output is interleaved between DQd, DId, DQ, DI
  //   DI bus
  //   DId bus
  //   DQ bus
  //   DQd bus
endmodule
